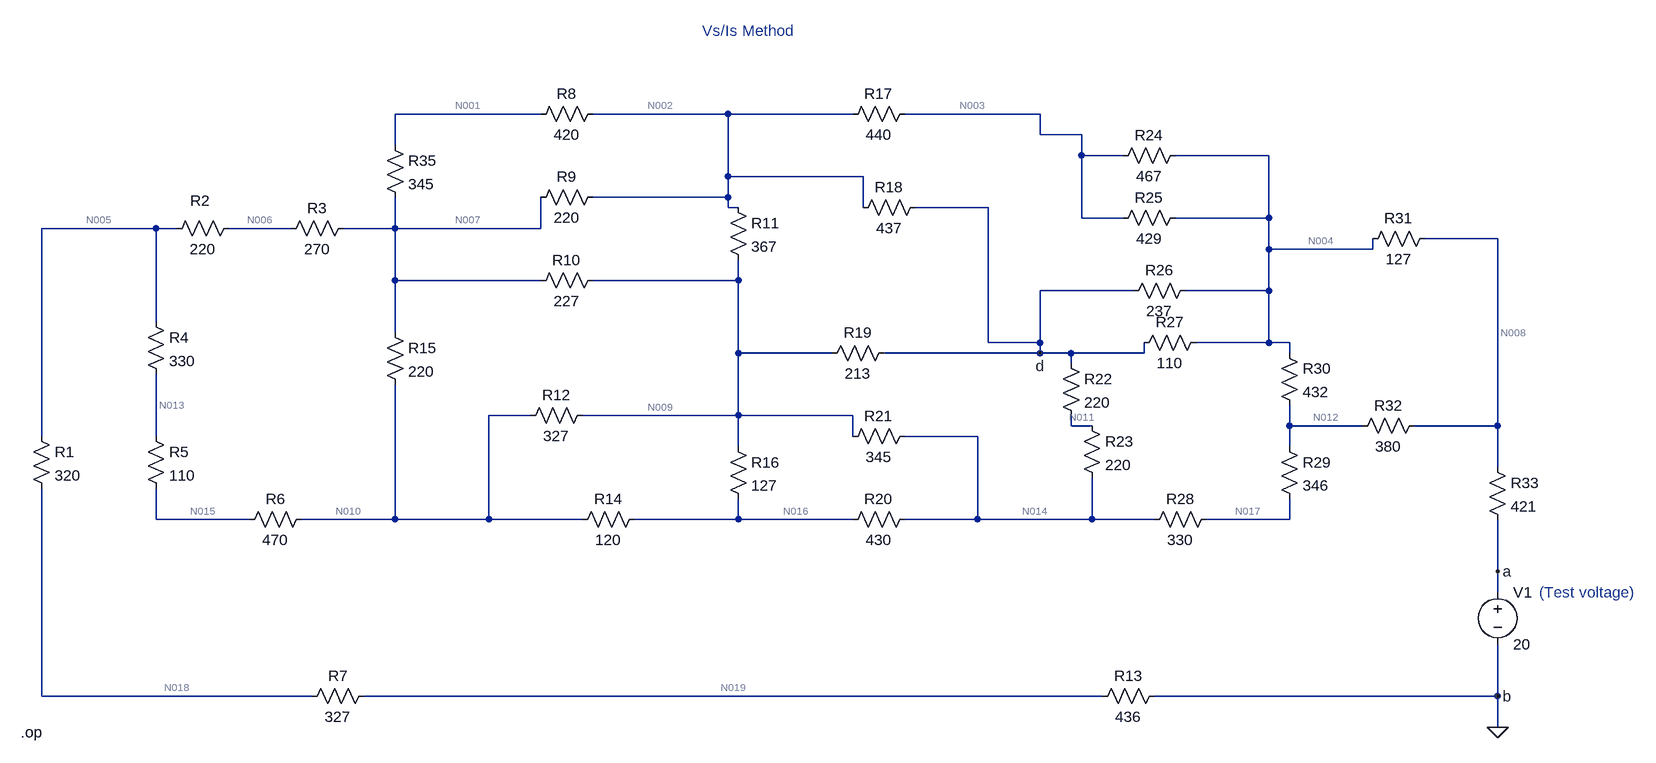
[diagram p0: schematic OELSim1102_00725205131037_b.asc]
OELSim1102_00725205131037_b.asc, the LTspice schematic file:
Version 4.1
SHEET 1 2372 824
WIRE 672 -144 448 -144
WIRE 960 -144 752 -144
WIRE 1152 -144 960 -144
WIRE 1440 -144 1232 -144
WIRE 1440 -112 1440 -144
WIRE 1504 -112 1440 -112
WIRE 448 -96 448 -144
WIRE 1504 -80 1504 -112
WIRE 1568 -80 1504 -80
WIRE 1792 -80 1648 -80
WIRE 960 -48 960 -144
WIRE 1168 -48 960 -48
WIRE 960 -16 960 -48
WIRE 960 -16 752 -16
WIRE 960 0 960 -16
WIRE 976 0 960 0
WIRE 1168 0 1168 -48
WIRE 1360 0 1248 0
WIRE 1504 16 1504 -80
WIRE 1568 16 1504 16
WIRE 1792 16 1792 -80
WIRE 1792 16 1648 16
WIRE 80 32 -96 32
WIRE 112 32 80 32
WIRE 288 32 192 32
WIRE 448 32 448 -16
WIRE 448 32 368 32
WIRE 672 32 672 -16
WIRE 672 32 448 32
WIRE 2144 48 2032 48
WIRE 1792 64 1792 16
WIRE 1952 64 1952 48
WIRE 1952 64 1792 64
WIRE 448 112 448 32
WIRE 672 112 448 112
WIRE 976 112 976 80
WIRE 976 112 752 112
WIRE 1584 128 1440 128
WIRE 1792 128 1792 64
WIRE 1792 128 1664 128
WIRE 80 176 80 32
WIRE 448 192 448 112
WIRE 1360 208 1360 0
WIRE 1440 208 1440 128
WIRE 1440 208 1360 208
WIRE 1792 208 1792 128
WIRE 1792 208 1680 208
WIRE 1824 208 1792 208
WIRE 976 224 976 112
WIRE 1120 224 976 224
WIRE 1440 224 1440 208
WIRE 1440 224 1200 224
WIRE 1488 224 1440 224
WIRE 1600 224 1600 208
WIRE 1600 224 1488 224
WIRE 1824 224 1824 208
WIRE 1488 240 1488 224
WIRE 656 320 592 320
WIRE 976 320 976 224
WIRE 976 320 736 320
WIRE 1152 320 976 320
WIRE 1488 336 1488 320
WIRE 1520 336 1488 336
WIRE 1824 336 1824 304
WIRE 1936 336 1824 336
WIRE 2144 336 2144 48
WIRE 2144 336 2016 336
WIRE -96 352 -96 32
WIRE 80 352 80 256
WIRE 1152 352 1152 320
WIRE 1344 352 1232 352
WIRE 976 368 976 320
WIRE 1824 368 1824 336
WIRE 2144 400 2144 336
WIRE 80 480 80 432
WIRE 224 480 80 480
WIRE 448 480 448 272
WIRE 448 480 304 480
WIRE 592 480 592 320
WIRE 592 480 448 480
WIRE 736 480 592 480
WIRE 976 480 976 448
WIRE 976 480 816 480
WIRE 1152 480 976 480
WIRE 1344 480 1344 352
WIRE 1344 480 1232 480
WIRE 1520 480 1520 416
WIRE 1520 480 1344 480
WIRE 1616 480 1520 480
WIRE 1824 480 1824 448
WIRE 1824 480 1696 480
WIRE 2144 560 2144 480
WIRE 2144 592 2144 560
WIRE -96 752 -96 432
WIRE 320 752 -96 752
WIRE 1536 752 400 752
WIRE 2144 752 2144 672
WIRE 2144 752 1616 752
WIRE 2144 800 2144 752
FLAG 1440 224 d
FLAG 2144 560 a
FLAG 2144 752 b
FLAG 2144 800 0
SYMBOL res -112 336 R0
SYMATTR InstName R1
SYMATTR Value 320
SYMBOL res 208 16 R90
WINDOW 0 -11 60 VBottom 2
WINDOW 3 32 56 VTop 2
SYMATTR InstName R2
SYMATTR Value 220
SYMBOL res 384 16 R90
WINDOW 0 0 56 VBottom 2
WINDOW 3 32 56 VTop 2
SYMATTR InstName R3
SYMATTR Value 270
SYMBOL res 64 160 R0
SYMATTR InstName R4
SYMATTR Value 330
SYMBOL res 64 336 R0
SYMATTR InstName R5
SYMATTR Value 110
SYMBOL res 320 464 R90
WINDOW 0 0 56 VBottom 2
WINDOW 3 32 56 VTop 2
SYMATTR InstName R6
SYMATTR Value 470
SYMBOL res 416 736 R90
WINDOW 0 0 56 VBottom 2
WINDOW 3 32 56 VTop 2
SYMATTR InstName R7
SYMATTR Value 327
SYMBOL res 432 176 R0
SYMATTR InstName R15
SYMATTR Value 220
SYMBOL res 768 -32 R90
WINDOW 0 0 56 VBottom 2
WINDOW 3 32 56 VTop 2
SYMATTR InstName R9
SYMATTR Value 220
SYMBOL res 768 96 R90
WINDOW 0 0 56 VBottom 2
WINDOW 3 32 56 VTop 2
SYMATTR InstName R10
SYMATTR Value 227
SYMBOL res 960 -16 R0
SYMATTR InstName R11
SYMATTR Value 367
SYMBOL res 752 304 R90
WINDOW 0 0 56 VBottom 2
WINDOW 3 32 56 VTop 2
SYMATTR InstName R12
SYMATTR Value 327
SYMBOL res 832 464 R90
WINDOW 0 0 56 VBottom 2
WINDOW 3 32 56 VTop 2
SYMATTR InstName R14
SYMATTR Value 120
SYMBOL res 960 352 R0
SYMATTR InstName R16
SYMATTR Value 127
SYMBOL res 1248 -160 R90
WINDOW 0 0 56 VBottom 2
WINDOW 3 32 56 VTop 2
SYMATTR InstName R17
SYMATTR Value 440
SYMBOL res 1264 -16 R90
WINDOW 0 0 56 VBottom 2
WINDOW 3 32 56 VTop 2
SYMATTR InstName R18
SYMATTR Value 437
SYMBOL res 1216 208 R90
WINDOW 0 0 56 VBottom 2
WINDOW 3 32 56 VTop 2
SYMATTR InstName R19
SYMATTR Value 213
SYMBOL res 1248 464 R90
WINDOW 0 0 56 VBottom 2
WINDOW 3 32 56 VTop 2
SYMATTR InstName R20
SYMATTR Value 430
SYMBOL res 1248 336 R90
WINDOW 0 0 56 VBottom 2
WINDOW 3 32 56 VTop 2
SYMATTR InstName R21
SYMATTR Value 345
SYMBOL res 1472 224 R0
SYMATTR InstName R22
SYMATTR Value 220
SYMBOL res 1504 320 R0
SYMATTR InstName R23
SYMATTR Value 220
SYMBOL res 1664 -96 R90
WINDOW 0 0 56 VBottom 2
WINDOW 3 32 56 VTop 2
SYMATTR InstName R24
SYMATTR Value 467
SYMBOL res 1664 0 R90
WINDOW 0 0 56 VBottom 2
WINDOW 3 32 56 VTop 2
SYMATTR InstName R25
SYMATTR Value 429
SYMBOL res 1680 112 R90
WINDOW 0 0 56 VBottom 2
WINDOW 3 32 56 VTop 2
SYMATTR InstName R26
SYMATTR Value 237
SYMBOL res 1696 192 R90
WINDOW 0 0 56 VBottom 2
WINDOW 3 32 56 VTop 2
SYMATTR InstName R27
SYMATTR Value 110
SYMBOL res 1712 464 R90
WINDOW 0 0 56 VBottom 2
WINDOW 3 32 56 VTop 2
SYMATTR InstName R28
SYMATTR Value 330
SYMBOL res 1808 352 R0
SYMATTR InstName R29
SYMATTR Value 346
SYMBOL res 1808 208 R0
SYMATTR InstName R30
SYMATTR Value 432
SYMBOL res 2048 32 R90
WINDOW 0 0 56 VBottom 2
WINDOW 3 32 56 VTop 2
SYMATTR InstName R31
SYMATTR Value 127
SYMBOL res 2032 320 R90
WINDOW 0 0 56 VBottom 2
WINDOW 3 32 56 VTop 2
SYMATTR InstName R32
SYMATTR Value 380
SYMBOL res 2128 384 R0
SYMATTR InstName R33
SYMATTR Value 421
SYMBOL res 432 -112 R0
SYMATTR InstName R35
SYMATTR Value 345
SYMBOL res 768 -160 R90
WINDOW 0 0 56 VBottom 2
WINDOW 3 32 56 VTop 2
SYMATTR InstName R8
SYMATTR Value 420
SYMBOL res 1632 736 R90
WINDOW 0 0 56 VBottom 2
WINDOW 3 32 56 VTop 2
SYMATTR InstName R13
SYMATTR Value 436
SYMBOL voltage 2144 576 R0
WINDOW 123 0 0 Left 0
WINDOW 39 0 0 Left 0
SYMATTR InstName V1
SYMATTR Value 20
TEXT -128 808 Left 2 !.op
TEXT 2208 592 Left 2 ;(Test voltage)
TEXT 920 -272 Left 2 ;Vs/Is Method

The netlist it stands for:
* OELSim1102_00725205131037_b.asc
R1 N005 N018 320
R2 N006 N005 220
R3 N007 N006 270
R4 N005 N013 330
R5 N013 N015 110
R6 N010 N015 470
R7 N019 N018 327
R15 N007 N010 220
R9 N002 N007 220
R10 N009 N007 227
R11 N002 N009 367
R12 N009 N010 327
R14 N016 N010 120
R16 N009 N016 127
R17 N003 N002 440
R18 d N002 437
R19 d N009 213
R20 N014 N016 430
R21 N014 N009 345
R22 d N011 220
R23 N011 N014 220
R24 N004 N003 467
R25 N004 N003 429
R26 N004 d 237
R27 N004 d 110
R28 N017 N014 330
R29 N012 N017 346
R30 N004 N012 432
R31 N008 N004 127
R32 N008 N012 380
R33 N008 a 421
R35 N001 N007 345
R8 N002 N001 420
R13 0 N019 436
V1 a 0 20
.op
* (Test voltage)
* Vs/Is Method
.backanno
.end

* Results of the author's LTspice run, read from the files saved beside the schematic
* Operating Point:
*   V(a) = 20 V
*   V(d) = 14.59 V
*   V(n001) = 13.54 V
*   V(n002) = 13.85 V
*   V(n003) = 14.65 V
*   V(n004) = 15.05 V
*   V(n005) = 10.29 V
*   V(n006) = 11.63 V
*   V(n007) = 13.28 V
*   V(n008) = 16 V
*   V(n009) = 13.81 V
*   V(n010) = 13.37 V
*   V(n011) = 14.4 V
*   V(n012) = 15.24 V
*   V(n013) = 11.4 V
*   V(n014) = 14.21 V
*   V(n015) = 11.78 V
*   V(n016) = 13.66 V
*   V(n017) = 14.71 V
*   V(n018) = 7.247 V
*   V(n019) = 4.141 V
*   I(R1) = 9.498 mA
*   I(R10) = 2.345 mA
*   I(R11) = 113.2 µA
*   I(R12) = 1.354 mA
*   I(R13) = -9.498 mA
*   I(R14) = 2.441 mA
*   I(R15) = -406.9 µA
*   I(R16) = 1.179 mA
*   I(R17) = 1.799 mA
*   I(R18) = 1.673 mA
*   I(R19) = 3.627 mA
*   I(R2) = 6.11 mA
*   I(R20) = 1.262 mA
*   I(R21) = 1.138 mA
*   I(R22) = 863 µA
*   I(R23) = 863 µA
*   I(R24) = 861.4 µA
*   I(R25) = 937.7 µA
*   I(R26) = 1.953 mA
*   I(R27) = 4.209 mA
*   I(R28) = 1.537 mA
*   I(R29) = 1.537 mA
*   I(R3) = 6.11 mA
*   I(R30) = -454.7 µA
*   I(R31) = 7.506 mA
*   I(R32) = 1.992 mA
*   I(R33) = -9.498 mA
*   I(R35) = 750.1 µA
*   I(R4) = -3.388 mA
*   I(R5) = -3.388 mA
*   I(R6) = 3.388 mA
*   I(R7) = -9.498 mA
*   I(R8) = 750.1 µA
*   I(R9) = 2.608 mA
*   I(V1) = -9.498 mA